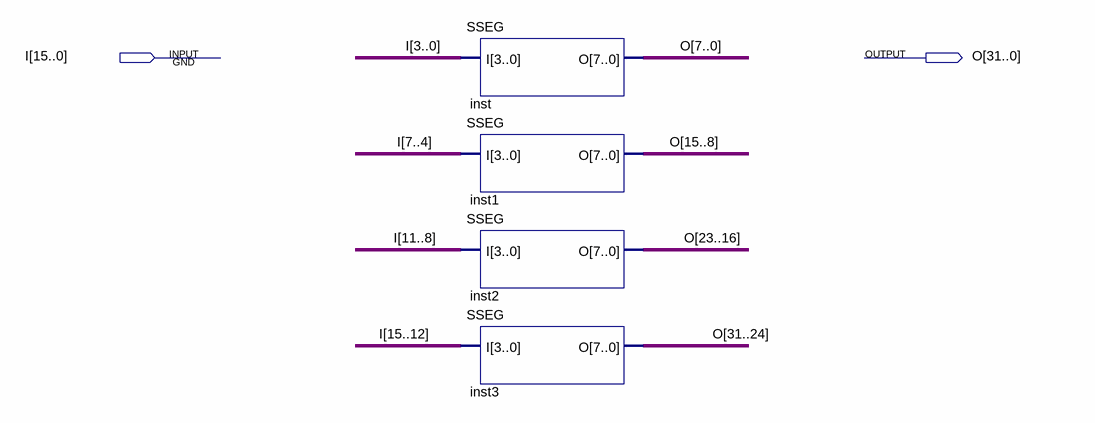
[diagram p0: schematic sheet]
// Quartus schematic SSEG4D.bdf as structural Verilog: 4 symbols, 2 pins
module SSEG4D (
  input  [15:0] I,
  output [31:0] O
);

  SSEG inst (.I(I[3:0]), .O(O[7:0]));
  SSEG inst1 (.I(I[7:4]), .O(O[15:8]));
  SSEG inst2 (.I(I[11:8]), .O(O[23:16]));
  SSEG inst3 (.I(I[15:12]), .O(O[31:24]));
endmodule
